# Altium schematic sheet tube-socket-in-8.SchDoc
size A; SheetNumber: 1; SheetTotal: 1
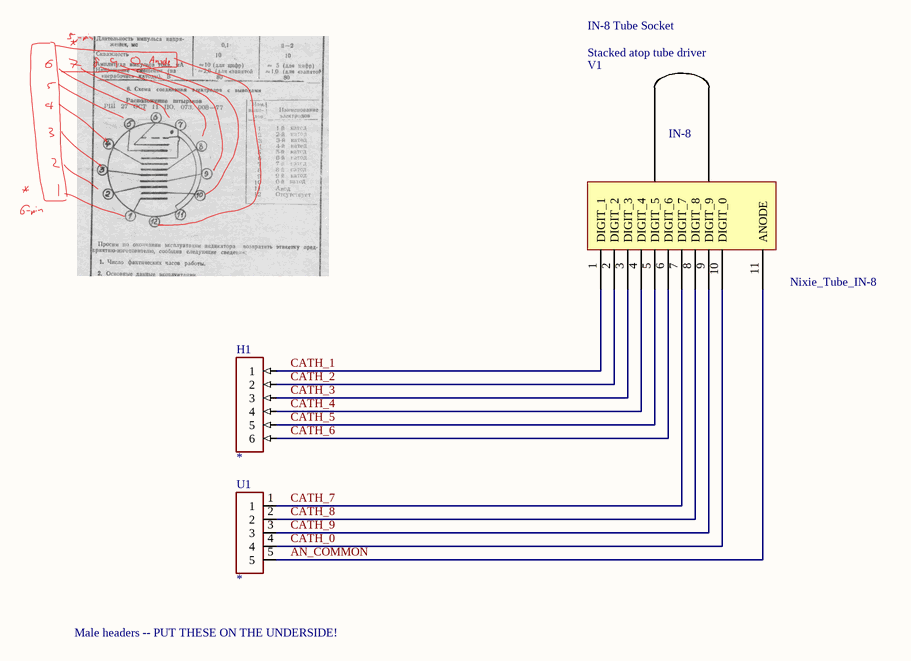
[diagram p0: tube-socket-in-8.SchDoc]

## Parts
H1  2.54-1x6P  [2.54-1x6P]  (value not drawn)
U1  HX PZ2.54-1x5P ZZ  [HX PZ2.54-1x5P ZZ]  (value not drawn)
V1  Nixie_Tube_IN-8  [Nixie_Tube_IN-8]

## Nets
AN_COMMON: U1.5 V1.11(ANODE)
CATH_0: U1.4 V1.10(DIGIT_0)
CATH_1: H1.1 V1.1(DIGIT_1)
CATH_2: H1.2 V1.2(DIGIT_2)
CATH_3: H1.3 V1.3(DIGIT_3)
CATH_4: H1.4 V1.4(DIGIT_4)
CATH_5: H1.5 V1.5(DIGIT_5)
CATH_6: H1.6 V1.6(DIGIT_6)
CATH_7: U1.1 V1.7(DIGIT_7)
CATH_8: U1.2 V1.8(DIGIT_8)
CATH_9: U1.3 V1.9(DIGIT_9)

## Notes on the sheet
- IN-8 Tube Socket
- Stacked atop tube driver
- Male headers -- PUT THESE ON THE UNDERSIDE!
- (in symbol Nixie_Tube_IN-8) IN-8

## Library data of the parts
H1 = 2.54-1x6P: Pin Headers. -40C~+105C 1 1x6P 2.54mm 2.5mm 3A 3mm 6P 6mm Black Brass Gold Pin Header Through Hole ,P=2.54mm Pin Headers ROHS; Manufacturer: BOOMELE(Boom Precision Elec); Component Type: Standard; Design Item ID: 2.54-1x6P; Value: *; JLCPCB Part #: C37208; Manufacturer Part Number: 2.54-1x6P
U1 = HX PZ2.54-1x5P ZZ: Pin Headers. -40C~+105C 1 1kV 1x5P 2.54mm 2.5mm 3A 3mm 5P 6mm Black Brass Gold Pin Header Through Hole Plugin,P=2.54mm Pin Headers ROHS; Manufacturer: hanxia; Component Type: Integrated Circuits; Design Item ID: HX PZ2.54-1x5P ZZ; Value: *; JLCPCB Part #: C32713271; Manufacturer Part Number: HX PZ2.54-1x5P ZZ